# Altium schematic sheet dsp.SchDoc
size 420 x 297 mm; Address1: Address1; Address2: Address2; Address3: Address3; Address4: Address4; DocumentNumber: АБВГ.123456.001 Э3; SheetNumber: 2; SheetTotal: 3; Scale: 1:1; DocumentType: Схема электрическая принципиальная; FirstReferrence: АБВГ.123456.001
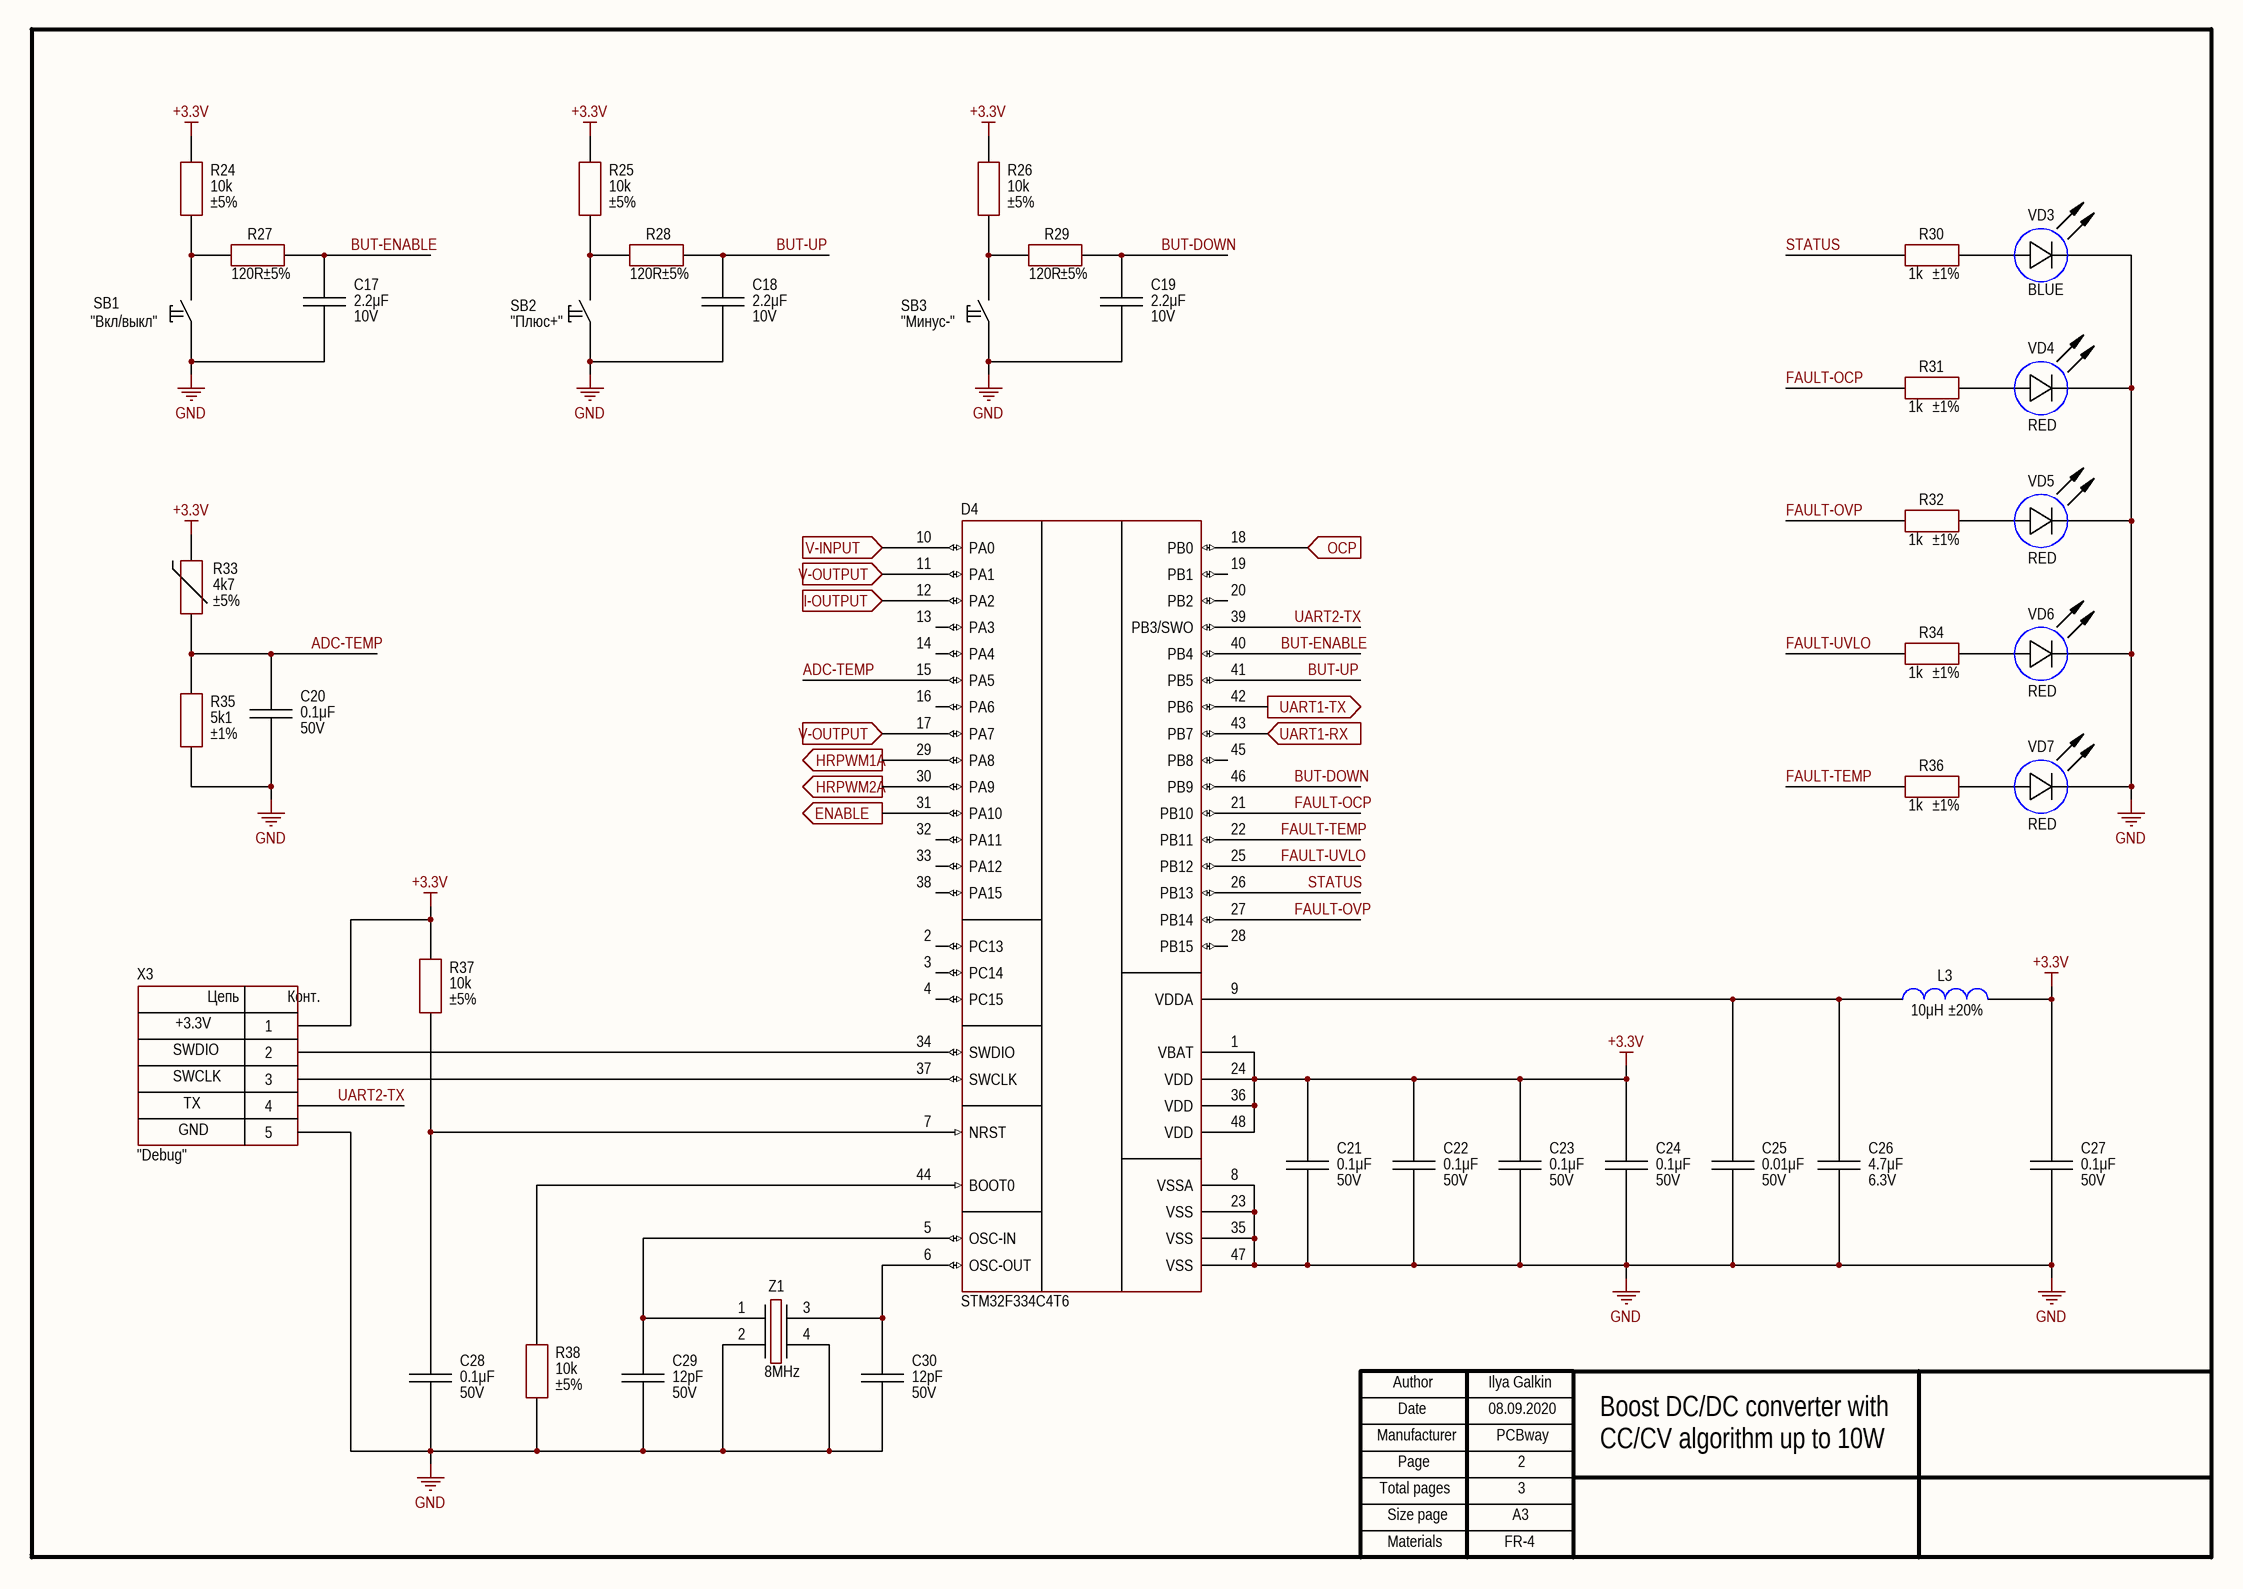
[diagram p0: dsp.SchDoc]

## Parts
C17  value 2.2μF  Voltage: 10V  [CAP: 0603]
C18  value 2.2μF  Voltage: 10V  [CAP: 0603]
C19  value 2.2μF  Voltage: 10V  [CAP: 0603]
C20  value 0.1μF  Voltage: 50V  [CAP: 0603]
C21  value 0.1μF  Voltage: 50V  [CAP: 0603]
C22  value 0.1μF  Voltage: 50V  [CAP: 0603]
C23  value 0.1μF  Voltage: 50V  [CAP: 0603]
C24  value 0.1μF  Voltage: 50V  [CAP: 0603]
C25  value 0.01μF  Voltage: 50V  [CAP: 0603]
C26  value 4.7μF  Voltage: 6.3V  [CAP: 0603]
C27  value 0.1μF  Voltage: 50V  [CAP: 0603]
C28  value 0.1μF  Voltage: 50V  [CAP: 0603]
C29  value 12pF  Voltage: 50V  [CAP: 0603]
C30  value 12pF  Voltage: 50V  [CAP: 0603]
D4  PartNumber: STM32F334C4T6  [48-LQFP]
L3  value 10μH  Tolerance: ±20%  [IND: 0603]
R24  value 10k  Tolerance: ±5%  [RES: 0603]
R25  value 10k  Tolerance: ±5%  [RES: 0603]
R26  value 10k  Tolerance: ±5%  [RES: 0603]
R27  value 120R  Tolerance: ±5%  [RES: 0603]
R28  value 120R  Tolerance: ±5%  [RES: 0603]
R29  value 120R  Tolerance: ±5%  [RES: 0603]
R30  value 1k  Tolerance: ±1%  [RES: 0603]
R31  value 1k  Tolerance: ±1%  [RES: 0603]
R32  value 1k  Tolerance: ±1%  [RES: 0603]
R33  value 4k7  Tolerance: ±5%  [RES: 0603]
R34  value 1k  Tolerance: ±1%  [RES: 0603]
R35  value 5k1  Tolerance: ±1%  [RES: 0603]
R36  value 1k  Tolerance: ±1%  [RES: 0603]
R37  value 10k  Tolerance: ±5%  [RES: 0603]
R38  value 10k  Tolerance: ±5%  [RES: 0603]
SB1  CommentText: "Вкл/выкл"  [BUT: 6x3.5 SMD]
SB2  CommentText: "Плюс+"  [BUT: 6x3.5 SMD]
SB3  CommentText: "Минус-"  [BUT: 6x3.5 SMD]
VD3  Color: BLUE  [LED: 0603B]
VD4  Color: RED  [LED: 0603R]
VD5  Color: RED  [LED: 0603R]
VD6  Color: RED  [LED: 0603R]
VD7  Color: RED  [LED: 0603R]
X3  CommentText: "Debug"  [CON: SM05B-GHS]
Z1  Frequency: 8MHz  [OSC: 3225]

## Ports
ENABLE (out), HRPWM1A (out), HRPWM2A (out), I-OUTPUT (in), OCP (in), UART1-RX (in), UART1-TX (out), V-INPUT (in), V-OUTPUT (in)

## Nets
+3.3V: C21.2 C22.2 C23.2 C24.2 C27.2 D4.1(VBAT) D4.24(VDD) D4.36(VDD) D4.48(VDD) L3.1 R24.2 R25.2 R26.2 R33.2 R37.2 X3.1
GND: C17.1 C18.1 C19.1 C20.1 C21.1 C22.1 C23.1 C24.1 C25.1 C26.1 C27.1 C28.1 C29.1 C30.1 D4.8(VSSA) D4.23(VSS) D4.35(VSS) D4.47(VSS) R35.1 R38.1 SB1.1 SB2.1 SB3.1 VD3.2(C) VD4.2(C) VD5.2(C) VD6.2(C) VD7.2(C) X3.5 Z1.2 Z1.4
ADC-TEMP: C20.2 D4.15(PA5) R33.1 R35.2
BUT-DOWN: C19.2 D4.46(PB9) R29.2
BUT-ENABLE: C17.2 D4.40(PB4) R27.2
BUT-UP: C18.2 D4.41(PB5) R28.2
ENABLE: D4.31(PA10) ; port ENABLE
FAULT-OCP: D4.21(PB10) R31.1
FAULT-OVP: D4.27(PB14) R32.1
FAULT-TEMP: D4.22(PB11) R36.1
FAULT-UVLO: D4.25(PB12) R34.1
HRPWM1A: D4.29(PA8) ; port HRPWM1A
HRPWM2A: D4.30(PA9) ; port HRPWM2A
I-OUTPUT: D4.12(PA2) ; port I-OUTPUT
OCP: D4.18(PB0) ; port OCP
STATUS: D4.26(PB13) R30.1
UART1-RX: D4.43(PB7) ; port UART1-RX
UART1-TX: D4.42(PB6) ; port UART1-TX
UART2-TX: D4.39(PB3/SWO) X3.4
V-INPUT: D4.10(PA0) ; port V-INPUT
V-OUTPUT: D4.11(PA1) D4.17(PA7) ; port V-OUTPUT
NetC25_2: C25.2 C26.2 D4.9(VDDA) L3.2
NetC28_2: C28.2 D4.7(NRST) R37.1
NetC29_2: C29.2 D4.5(OSC-IN) Z1.1
NetC30_2: C30.2 D4.6(OSC-OUT) Z1.3
NetD4_34: D4.34(SWDIO) X3.2
NetD4_37: D4.37(SWCLK) X3.3
NetD4_44: D4.44(BOOT0) R38.2
NetR24_1: R24.1 R27.1 SB1.2
NetR25_1: R25.1 R28.1 SB2.2
NetR26_1: R26.1 R29.1 SB3.2
NetR30_2: R30.2 VD3.1(A)
NetR31_2: R31.2 VD4.1(A)
NetR32_2: R32.2 VD5.1(A)
NetR34_2: R34.2 VD6.1(A)
NetR36_2: R36.2 VD7.1(A)

Not connected (* = marked no-connect by the designer): D4 2(PC13) 3(PC14) 4(PC15) 13(PA3) 14(PA4) 16(PA6) 19(PB1) 20(PB2) 28(PB15) 32(PA11) 33(PA12) 38(PA15) 45(PB8)

## Notes on the sheet
- SWDIO
- +3.3V
- SWCLK
- GND
- TX
- Ilya Galkin
- 08.09.2020
- PCBway
- 2
- Boost DC/DC converter with
- CC/CV algorithm up to 10W
- 3
- FR-4
- Author
- Manufacturer
- Date
- Page
- Total pages
- Size page
- A3
- Materials
- (in symbol Connector_SM05B) Цепь; Конт.

## Library data of the parts
C17-C19 = Ceramic_0603: Manufacturer: Samsung; PartNumber: CL10B225KP8NFNC; ValueManufacturerPartNumber: Ceramic capacitor, 2.2μF, X7R, ±10%, 10V, 0603, -55...+125°C; TypeCapacitor: Ceramic capacitor; Tolerance: ±10%; TypeDielectric: X7R; Package: 0603; HelpURL: https://www.digikey.com/product-detail/en/samsung-electro-mechanics/CL10B225KP8NFNC/1276-2016-1-ND/3890102; Temperature: -55...+125°C
C20-C24 C27 C28 = Ceramic_0603: Manufacturer: Samsung; PartNumber: CL10B104KB8NNNL; ValueManufacturerPartNumber: Ceramic capacitor, 0.1μF, X7R, ±10%, 50V, 0603, -55...+125°C; TypeCapacitor: Ceramic capacitor; Tolerance: ±10%; TypeDielectric: X7R; Package: 0603; HelpURL: https://www.digikey.com/product-detail/en/samsung-electro-mechanics/CL10B104KB8NNNL/1276-CL10B104KB8NNNLCT-ND/10320686; Temperature: -55...+125°C
C25 = Ceramic_0603: Manufacturer: Samsung; PartNumber: CL10B103KB8NNNC; ValueManufacturerPartNumber: Ceramic capacitor, 0.01μF, X7R, ±10%, 50V, 0603, -55...+125°C; TypeCapacitor: Ceramic capacitor; Tolerance: ±10%; TypeDielectric: X7R; Package: 0603; HelpURL: https://www.digikey.com/product-detail/en/samsung-electro-mechanics/CL10B103KB8NNNC/1276-1009-1-ND/3889095; Temperature: -55...+125°C
C26 = Ceramic_0603: Manufacturer: Samsung; PartNumber: CL10B475KQ8NQNC; ValueManufacturerPartNumber: Ceramic capacitor, 4.7μF, X7R, ±10%, 6.3V, 0603, -55...+125°C; TypeCapacitor: Ceramic capacitor; Tolerance: ±10%; TypeDielectric: X7R; Package: 0603; HelpURL: https://www.digikey.com/product-detail/en/samsung-electro-mechanics/CL10B475KQ8NQNC/1276-2087-6-ND/3892601; Temperature: -55...+125°C
C29 C30 = Ceramic_0603: Manufacturer: Samsung; PartNumber: CL10C120JB8NNNC; ValueManufacturerPartNumber: Ceramic capacitor, 12pF, NPO, ±10%, 50V, 0603, -55...+125°C; TypeCapacitor: Ceramic capacitor; Tolerance: ±10%; TypeDielectric: NPO; Package: 0603; HelpURL: https://www.digikey.com/product-detail/en/samsung-electro-mechanics/CL10C120JB8NNNC/1276-1254-1-ND/3889340; Temperature: -55...+125°C
D4 = STM32F334C8T6: Cortex-M4; Manufacturer: STMicroelectronics; ValueManufacturerPartNumber: IC microcontroller, 32-Bit, Cortex-M4, 72MHz, 64KB, 12KB, 2...3.6V, -40...+85°C, 48-LQFP; Supply: 2...3.6V; Speed: 72MHz; CoreSize: 32-Bit; MemoryROM: 64KB; MemoryRAM: 12KB; HelpURL: https://www.digikey.com/en/products/detail/stmicroelectronics/STM32F334C4T6/4989170?s=N4IgTCBcDaIMoBUCyBmMAxFKAsBhbCAbCALoC%2BQA; Package: 48-LQFP; ComponentType: IC microcontroller; Temperature: -40...+85°C; CoreProcessor: Cortex-M4
L3 = Inductor_0603: Manufacturer: Murata Electronics; PartNumber: LQM18FN100M00D; ValueManufacturerPartNumber: Fixed inductor, 10μH, ±20%, 0603, 50mA, -55...+125°C; TypeInductor: Fixed inductor; MaxCurrent: 50mA; Package: 0603; HelpURL: https://www.digikey.com/product-detail/en/murata-electronics-north-america/LQM18FN100M00D/490-4025-1-ND/1016285; Temperature: -55...+125°C
R24-R26 R37 R38 = Resistor_0603: Manufacturer: Yageo; PartNumber: RC0603JR-0710KL; ValueManufacturerPartNumber: Resistor film, 10k, ±5%, 0603, 0.1W, -55...+125°C; TypeResistor: Resistor film; Power: 0.1W; Package: 0603; HelpURL: https://www.digikey.com/product-detail/en/yageo/RC0603JR-0710KL/311-10KGRCT-ND/729647; Temperature: -55...+125°C
R27-R29 = Resistor_0603: Manufacturer: Yageo; PartNumber: RC0603JR-07120RL; ValueManufacturerPartNumber: Resistor film, 120R, ±5%, 0603, 0.1W, -55...+125°C; TypeResistor: Resistor film; Power: 0.1W; Package: 0603; HelpURL: https://www.digikey.com/product-detail/en/yageo/RC0603JR-07120RL/311-120GRCT-ND/729653; Temperature: -55...+125°C
R30-R32 R34 R36 = Resistor_0603: Manufacturer: Yageo; PartNumber: RC0603FR-071KL; ValueManufacturerPartNumber: Resistor film, 1k, ±1%, 0603, 0.1W, -55...+125°C; TypeResistor: Resistor film; Power: 0.1W; Package: 0603; HelpURL: https://www.digikey.com/product-detail/en/yageo/RC0603FR-071KL/311-1-00KHRCT-ND/729790; Temperature: -55...+125°C
R33 = NTC: Manufacturer: Murata; PartNumber: NCP18XM472J03RB; ValueManufacturerPartNumber: NTC resistor, 4k7, ±5%, 0603, 3500K, -55...+125°C; TypeResistor: NTC resistor; MaxCurrent: 3500K; Package: 0603; HelpURL: https://www.digikey.com/en/products/detail/murata-electronics/NCP18XM472J03RB/588460; Temperature: -55...+125°C
R35 = Resistor_0603: Manufacturer: Yageo; PartNumber: RC0603FR-075K1L; ValueManufacturerPartNumber: Resistor film, 5k1, ±1%, 0603, 0.1W, -55...+125°C; TypeResistor: Resistor film; Power: 0.1W; Package: 0603; HelpURL: https://www.digikey.com/product-detail/en/yageo/RC0603FR-075K1L/311-5-10KHRCT-ND/730215; Temperature: -55...+125°C
SB1-SB3 = Button_tactile: Manufacturer: C&K; ValueManufacturerPartNumber: Tactile button, 6x3.5mm; PartNumber: PTS636 SM43; TypeButton: Tactile button; HelpURL: https://www.digikey.com/product-detail/en/c-k/PTS636-SM43-SMTR-LFS/CKN12310-1-ND/10071745; Package: 6x3.5mm
VD3 = LED_single: Manufacturer: Wurth; ValueManufacturerPartNumber: LED, 20mA, 3.2V, 0603, -55...+150°C; PartNumber: 150060BS75000; TypeDiode: LED; Current: 20mA; VoltageDrop: 3.2V; Package: 0603; HelpURL: https://www.digikey.com/product-detail/en/w-rth-elektronik/150060BS75000/732-4966-1-ND/4489893; Temperature: -55...+150°C
VD4-VD7 = LED_single: Manufacturer: Wurth; ValueManufacturerPartNumber: LED, 20 mA, 2V, 0603, -55...+150°C; PartNumber: 150060RS75000; TypeDiode: LED; Current: 20 mA; VoltageDrop: 2V; Package: 0603; HelpURL: https://www.digikey.com/product-detail/en/w-rth-elektronik/150060RS75000/732-4978-1-ND/4489899; Temperature: -55...+150°C
X3 = Connector_SM05B: Manufacturer: JST; ValueManufacturerPartNumber: Connector, 5pin, 1.25mm, 50VDC, 1A; PartNumber: SM05B-GHS; VoltageMax: 50VDC; Pitch: 1.25mm; CurrentMax: 1A; Multichannel: 5pin; HelpURL: https://www.digikey.com/product-detail/en/jst-sales-america-inc/SM05B-GHS-TB-LF-SN/455-1567-1-ND/807835; TypeConnector: Connector
Z1 = Crystal_3225: Manufacturer: ECS; PartNumber: ECS-80-12-33-JGN-TR; ValueManufacturerPartNumber: Crystal, 8MHz, 12pF, ±30ppm, case 3225, -40...+85°C; LoadCapacitance: 12pF; Tolerance: ±30ppm; Package: case 3225; HelpURL: https://www.digikey.com/product-detail/en/ecs-inc/ECS-80-12-33-JGN-TR/50-ECS-80-12-33-JGN-CT-ND/10478769; Temperature: -40...+85°C; TypeOscilator: Crystal